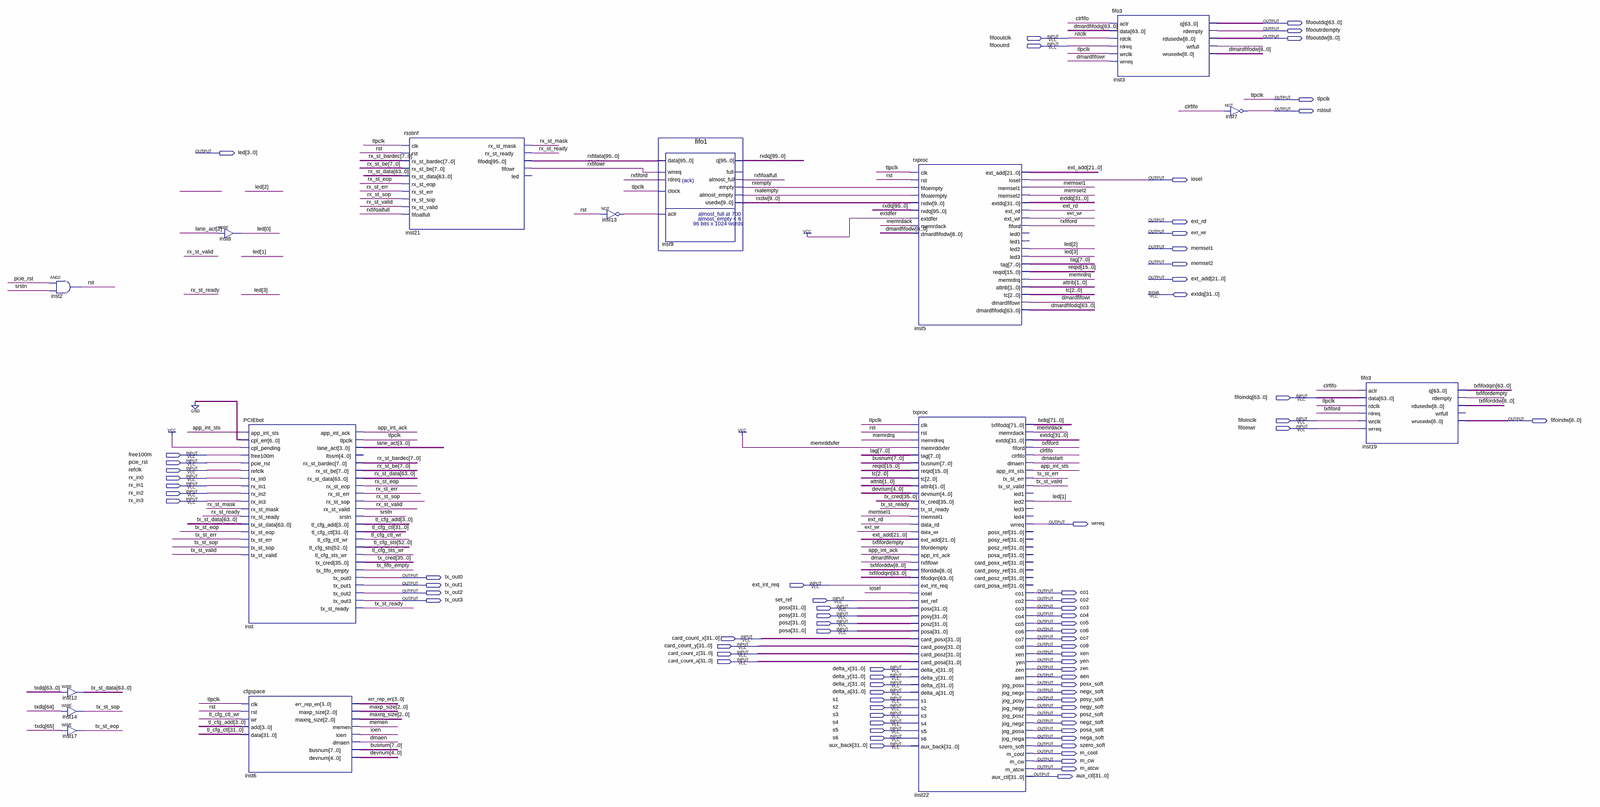
[diagram p0: schematic sheet, whole]
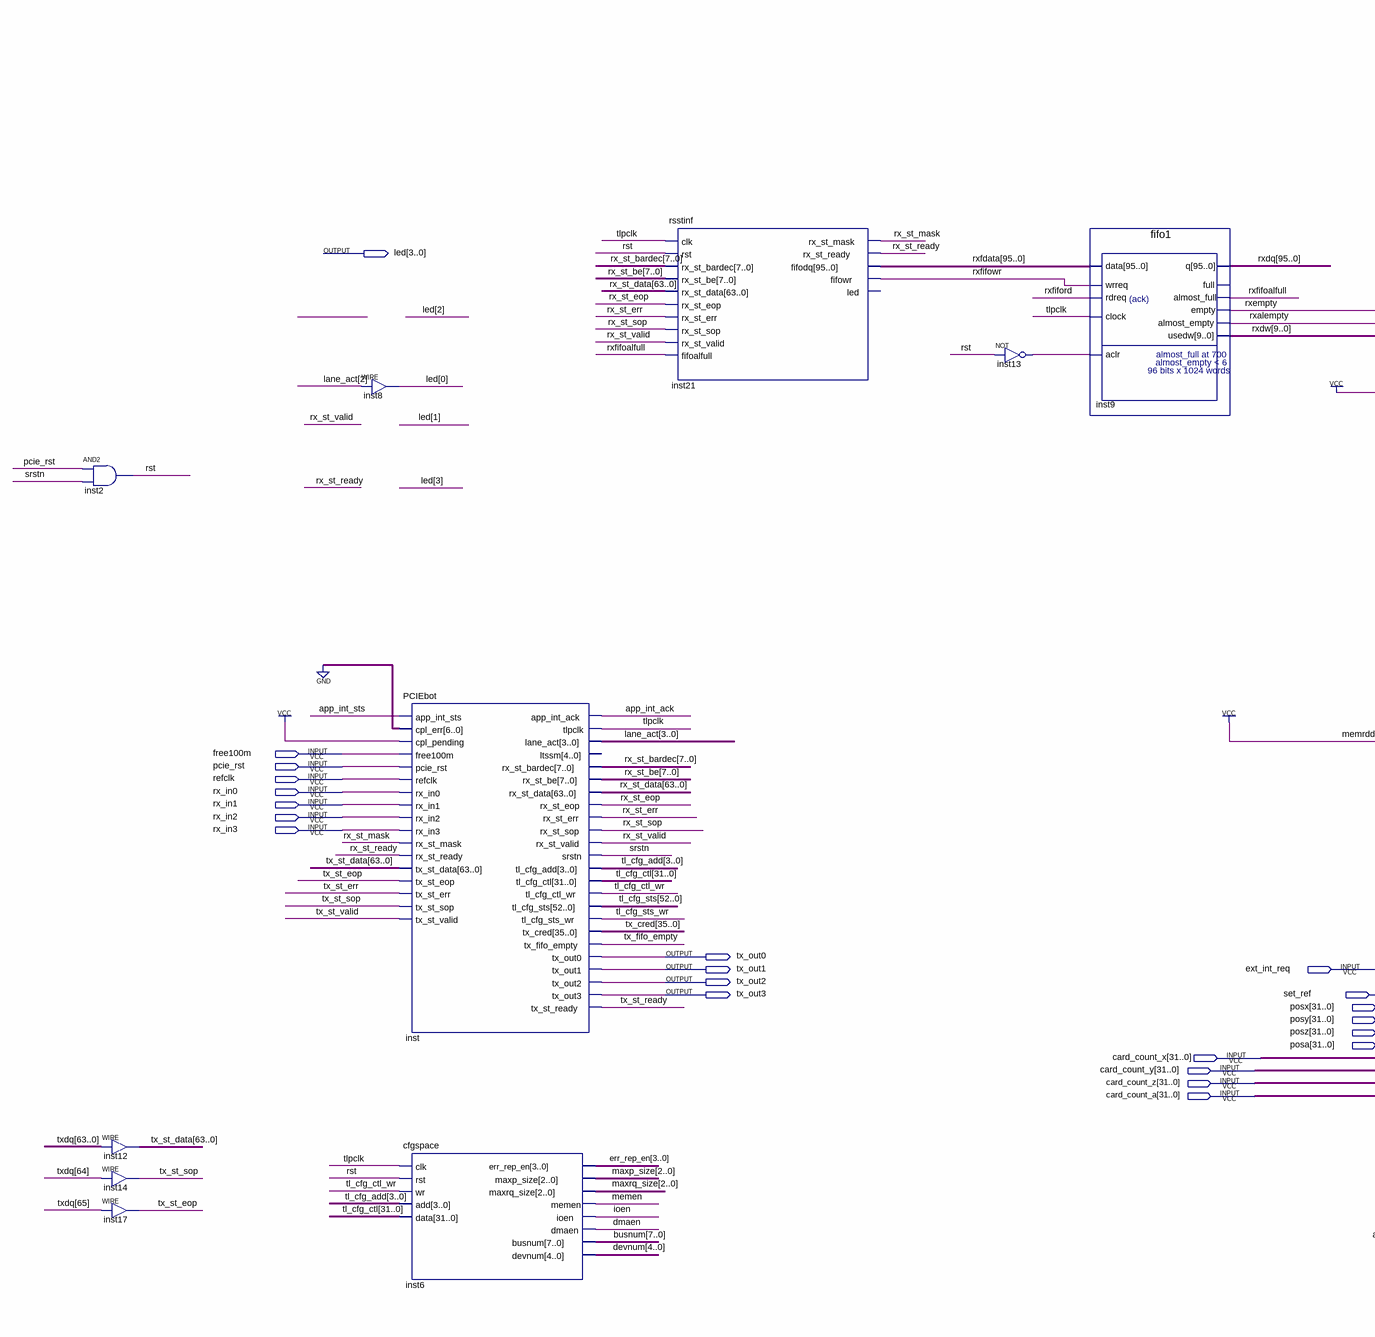
[diagram p1: schematic sheet, left part]
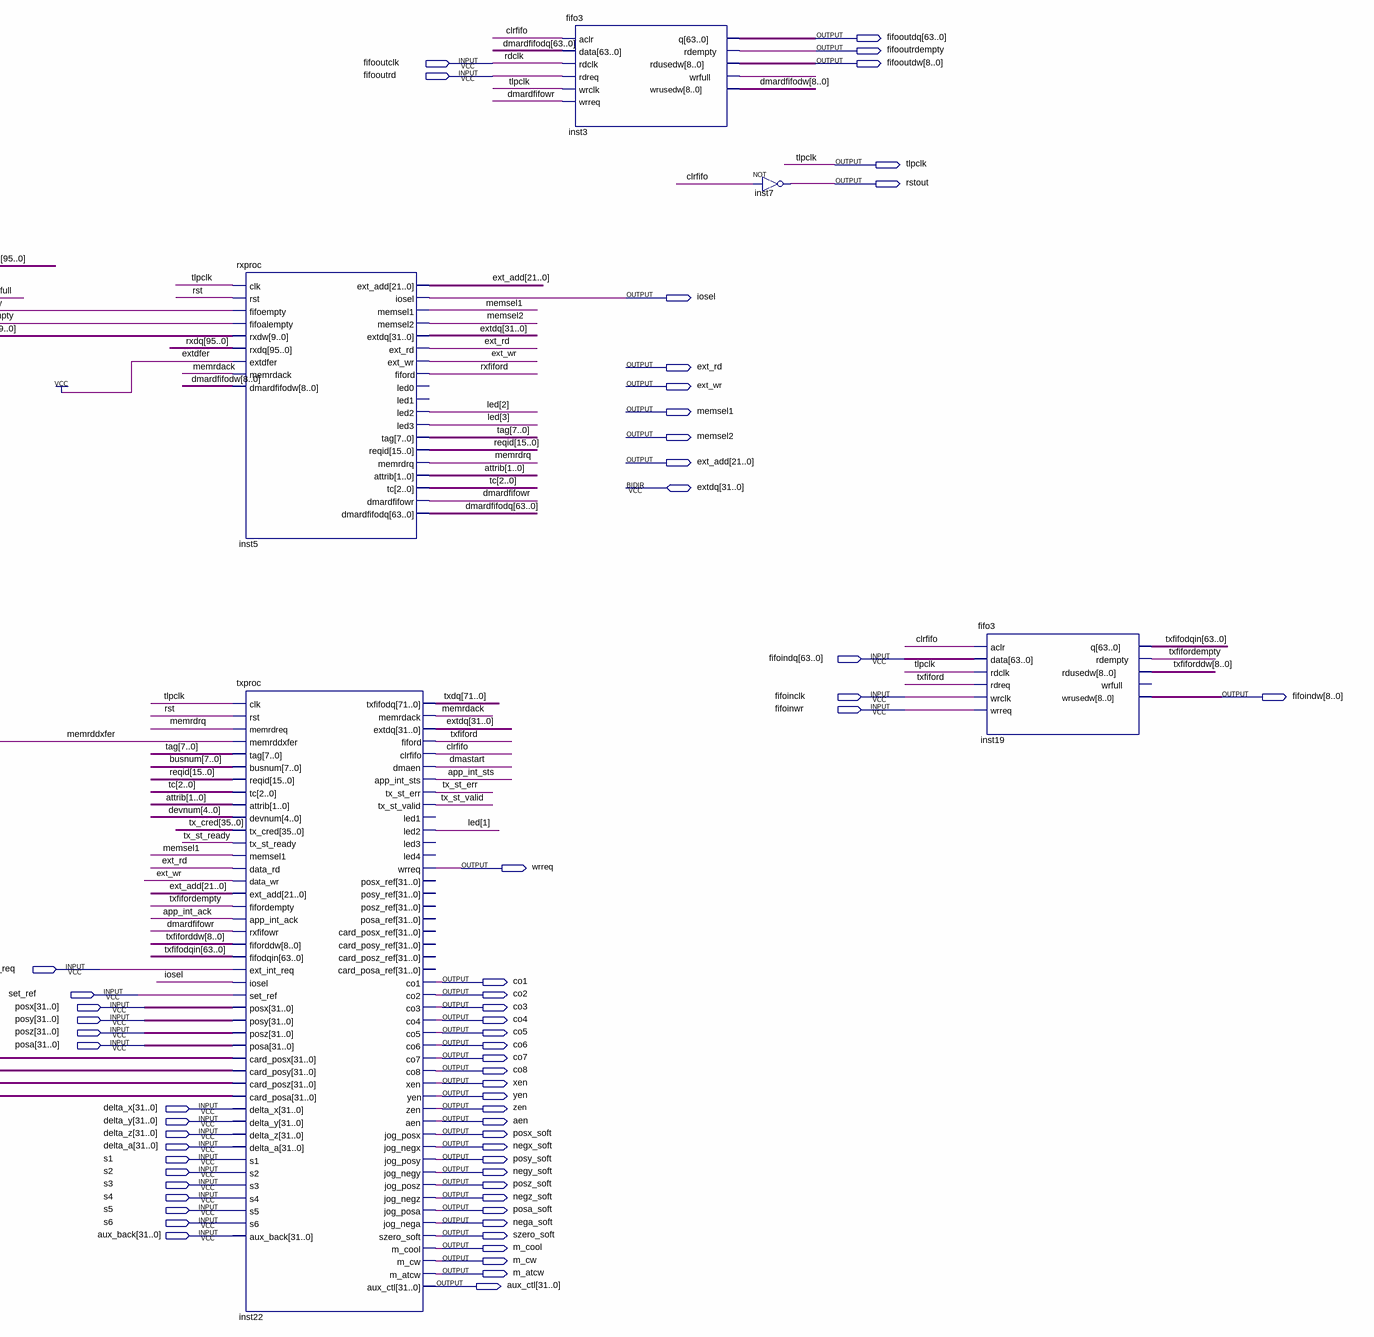
[diagram p2: schematic sheet, right part]
// Quartus schematic PCIECORE.bdf as structural Verilog: 15 symbols, 77 pins
module PCIECORE (
  input  fifooutclk,
  input  fifooutrd,
  input  [63:0] fifoindq,
  input  fifoinclk,
  input  fifoinwr,
  input  free100m,
  input  pcie_rst,
  input  refclk,
  input  rx_in0,
  input  rx_in1,
  input  rx_in2,
  input  rx_in3,
  input  ext_int_req,
  input  set_ref,
  input  [31:0] posx,
  input  [31:0] posy,
  input  [31:0] posz,
  input  [31:0] posa,
  input  [31:0] card_count_x,
  input  [31:0] card_count_y,
  input  [31:0] card_count_z,
  input  [31:0] card_count_a,
  input  [31:0] delta_x,
  input  [31:0] delta_y,
  input  [31:0] delta_z,
  input  [31:0] delta_a,
  input  s1,
  input  s2,
  input  s3,
  input  s4,
  input  s5,
  input  s6,
  input  [31:0] aux_back,
  inout  [31:0] extdq,
  output [63:0] fifooutdq,
  output fifooutrdempty,
  output [8:0] fifooutdw,
  output tlpclk,
  output rstout,
  output [3:0] led,
  output iosel,
  output ext_rd,
  output ext_wr,
  output memsel1,
  output memsel2,
  output [21:0] ext_add,
  output [8:0] fifoindw,
  output wrreq,
  output tx_out0,
  output tx_out1,
  output tx_out2,
  output co1,
  output tx_out3,
  output co2,
  output co3,
  output co4,
  output co5,
  output co6,
  output co7,
  output co8,
  output xen,
  output yen,
  output zen,
  output aen,
  output posx_soft,
  output negx_soft,
  output posy_soft,
  output negy_soft,
  output posz_soft,
  output negz_soft,
  output posa_soft,
  output nega_soft,
  output szero_soft,
  output m_cool,
  output m_cw,
  output m_atcw,
  output [31:0] aux_ctl
);

  wire app_int_ack, app_int_sts, clrfifo, dmaen, dmardfifowr, dmastart, inst3_wrfull, inst13_out, ioen,
       memen, memrdack, memrdrq, rst, rx_st_eop, rx_st_err, rx_st_mask, rx_st_ready, rx_st_sop, rx_st_valid,
       rxalempty, rxempty, rxfifoalfull, rxfiford, rxfifowr, srstn, tl_cfg_ctl_wr, tl_cfg_sts_wr,
       tx_fifo_empty, tx_st_eop, tx_st_err, tx_st_ready, tx_st_sop, tx_st_valid, txfiford, txfifordempty;
  wire [1:0] attrib;
  wire [2:0] maxp_size, maxrq_size, tc;
  wire [3:0] err_rep_en, lane_act, tl_cfg_add;
  wire [4:0] devnum;
  wire [7:0] busnum, rx_st_bardec, rx_st_be, tag;
  wire [8:0] dmardfifodw, txfiforddw;
  wire [9:0] rxdw;
  wire [15:0] reqid;
  wire [31:0] tl_cfg_ctl;
  wire [35:0] tx_cred;
  wire [52:0] tl_cfg_sts;
  wire [63:0] dmardfifodq, rx_st_data, tx_st_data, txfifodqin;
  wire [71:0] txdq;
  wire [95:0] rxdq, rxfdata;

  and inst2 (rst, pcie_rst, srstn);
  assign tx_st_data = txdq[63:0];  // WIRE inst12
  assign tx_st_sop = txdq[64];  // WIRE inst14
  assign tx_st_eop = txdq[65];  // WIRE inst17
  assign led[0] = lane_act[2];  // WIRE inst8
  PCIEbot inst (
    .app_int_sts(app_int_sts), .cpl_err({7{1'b0}}), .cpl_pending(1'b1), .free100m(free100m),
    .pcie_rst(pcie_rst), .refclk(refclk), .rx_in0(rx_in0), .rx_in1(rx_in1), .rx_in2(rx_in2), .rx_in3(rx_in3),
    .rx_st_mask(rx_st_mask), .rx_st_ready(rx_st_ready), .tx_st_data(tx_st_data), .tx_st_eop(tx_st_eop),
    .tx_st_err(tx_st_err), .tx_st_sop(tx_st_sop), .tx_st_valid(tx_st_valid), .app_int_ack(app_int_ack),
    .tlpclk(tlpclk), .lane_act(lane_act), .rx_st_bardec(rx_st_bardec), .rx_st_be(rx_st_be),
    .rx_st_data(rx_st_data), .rx_st_eop(rx_st_eop), .rx_st_err(rx_st_err), .rx_st_sop(rx_st_sop),
    .rx_st_valid(rx_st_valid), .srstn(srstn), .tl_cfg_add(tl_cfg_add), .tl_cfg_ctl(tl_cfg_ctl),
    .tl_cfg_ctl_wr(tl_cfg_ctl_wr), .tl_cfg_sts(tl_cfg_sts), .tl_cfg_sts_wr(tl_cfg_sts_wr), .tx_cred(tx_cred),
    .tx_fifo_empty(tx_fifo_empty), .tx_out0(tx_out0), .tx_out1(tx_out1), .tx_out2(tx_out2),
    .tx_out3(tx_out3), .tx_st_ready(tx_st_ready));  // open: ltssm
  cfgspace inst6 (
    .clk(tlpclk), .rst(rst), .wr(tl_cfg_ctl_wr), .add(tl_cfg_add), .data(tl_cfg_ctl),
    .err_rep_en(err_rep_en), .maxp_size(maxp_size), .maxrq_size(maxrq_size), .memen(memen), .ioen(ioen),
    .dmaen(dmaen), .busnum(busnum), .devnum(devnum));
  rsstinf inst21 (
    .clk(tlpclk), .rst(rst), .rx_st_bardec(rx_st_bardec), .rx_st_be(rx_st_be), .rx_st_data(rx_st_data),
    .rx_st_eop(rx_st_eop), .rx_st_err(rx_st_err), .rx_st_sop(rx_st_sop), .rx_st_valid(rx_st_valid),
    .fifoalfull(rxfifoalfull), .rx_st_mask(rx_st_mask), .rx_st_ready(rx_st_ready), .fifodq(rxfdata),
    .fifowr(rxfifowr));  // open: led
  not inst13 (inst13_out, rst);
  fifo1 inst9 (
    .data(rxfdata), .wrreq(rxfifowr), .rdreq(rxfiford), .clock(tlpclk), .aclr(inst13_out), .q(rxdq),
    .almost_full(rxfifoalfull), .empty(rxempty), .almost_empty(rxalempty), .usedw(rxdw));  // open: full
  rxproc inst5 (
    .clk(tlpclk), .rst(rst), .fifoempty(rxempty), .fifoalempty(rxalempty), .rxdw(rxdw), .rxdq(rxdq),
    .extdfer(1'b1), .memrdack(memrdack), .dmardfifodw(dmardfifodw), .ext_add(ext_add), .iosel(iosel),
    .memsel1(memsel1), .memsel2(memsel2), .ext_rd(ext_rd), .ext_wr(ext_wr), .fiford(rxfiford), .led2(led[2]),
    .led3(led[3]), .tag(tag), .reqid(reqid), .memrdrq(memrdrq), .attrib(attrib), .tc(tc),
    .dmardfifowr(dmardfifowr), .dmardfifodq(dmardfifodq), .extdq(extdq));  // open: led0, led1
  txproc inst22 (
    .clk(tlpclk), .rst(rst), .memrdreq(memrdrq), .memrddxfer(1'b1), .tag(tag), .busnum(busnum),
    .reqid(reqid), .tc(tc), .attrib(attrib), .devnum(devnum), .tx_cred(tx_cred), .tx_st_ready(tx_st_ready),
    .memsel1(memsel1), .data_rd(ext_rd), .data_wr(ext_wr), .ext_add(ext_add), .fifordempty(txfifordempty),
    .app_int_ack(app_int_ack), .rxfifowr(dmardfifowr), .fiforddw(txfiforddw), .fifodqin(txfifodqin),
    .ext_int_req(ext_int_req), .iosel(iosel), .set_ref(set_ref), .posx(posx), .posy(posy), .posz(posz),
    .posa(posa), .card_posx(card_count_x), .card_posy(card_count_y), .card_posz(card_count_z),
    .card_posa(card_count_a), .delta_x(delta_x), .delta_y(delta_y), .delta_z(delta_z), .delta_a(delta_a),
    .s1(s1), .s2(s2), .s3(s3), .s4(s4), .s5(s5), .s6(s6), .aux_back(aux_back), .txfifodq(txdq),
    .memrdack(memrdack), .fiford(txfiford), .clrfifo(clrfifo), .dmaen(dmastart), .app_int_sts(app_int_sts),
    .tx_st_err(tx_st_err), .tx_st_valid(tx_st_valid), .led2(led[1]), .wrreq(wrreq), .co1(co1), .co2(co2),
    .co3(co3), .co4(co4), .co5(co5), .co6(co6), .co7(co7), .co8(co8), .xen(xen), .yen(yen), .zen(zen),
    .aen(aen), .jog_posx(posx_soft), .jog_negx(negx_soft), .jog_posy(posy_soft), .jog_negy(negy_soft),
    .jog_posz(posz_soft), .jog_negz(negz_soft), .jog_posa(posa_soft), .jog_nega(nega_soft),
    .szero_soft(szero_soft), .m_cool(m_cool), .m_cw(m_cw), .m_atcw(m_atcw), .aux_ctl(aux_ctl), .extdq(extdq));  // open: led1, led3, led4, posx_ref, posy_ref, posz_ref, posa_ref, card_posx_ref, card_posy_ref, card_posz_ref, card_posa_ref
  fifo3 inst3 (
    .aclr(clrfifo), .data(dmardfifodq), .rdclk(fifooutclk), .rdreq(fifooutrd), .wrclk(tlpclk),
    .wrreq(dmardfifowr), .q(fifooutdq), .rdempty(fifooutrdempty), .rdusedw(fifooutdw), .wrfull(inst3_wrfull),
    .wrusedw(dmardfifodw));
  not inst7 (rstout, clrfifo);
  fifo3 inst19 (
    .aclr(clrfifo), .data(fifoindq), .rdclk(tlpclk), .rdreq(txfiford), .wrclk(fifoinclk), .wrreq(fifoinwr),
    .q(txfifodqin), .rdempty(txfifordempty), .rdusedw(txfiforddw), .wrusedw(fifoindw));  // open: wrfull

  // Other names for the same wires on the sheet: rdclk = fifooutclk
endmodule
